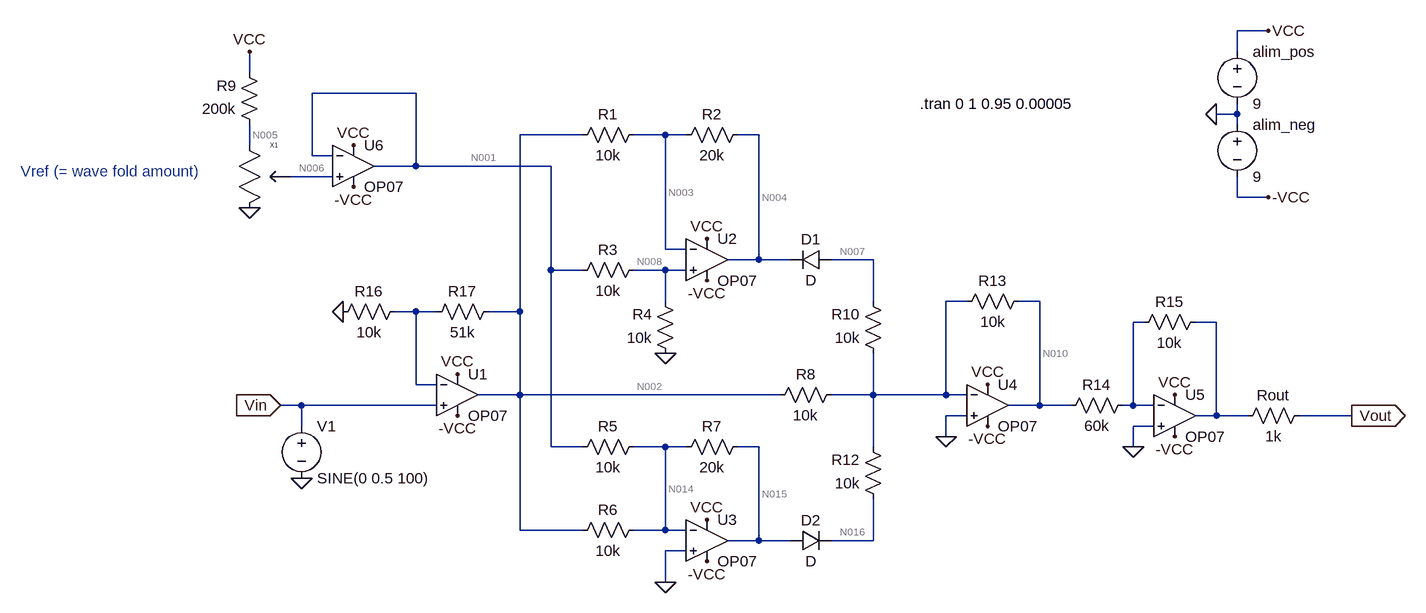
[diagram p0: schematic wave_folder.asc]
wave_folder.asc, the LTspice schematic file:
Version 4.1
SHEET 1 1104 780
WIRE 864 -384 816 -384
WIRE 816 -352 816 -384
WIRE -704 -320 -704 -352
WIRE -448 -288 -608 -288
WIRE 816 -256 816 -272
WIRE 816 -256 784 -256
WIRE 816 -240 816 -256
WIRE -192 -224 -288 -224
WIRE -64 -224 -112 -224
WIRE -32 -224 -64 -224
WIRE 80 -224 48 -224
WIRE -704 -208 -704 -240
WIRE -608 -192 -608 -288
WIRE -576 -192 -608 -192
WIRE -448 -176 -448 -288
WIRE -448 -176 -512 -176
WIRE -240 -176 -448 -176
WIRE -576 -160 -640 -160
WIRE 816 -128 816 -160
WIRE 864 -128 816 -128
WIRE -64 -48 -64 -224
WIRE -32 -48 -64 -48
WIRE 80 -32 80 -224
WIRE 80 -32 32 -32
WIRE 128 -32 80 -32
WIRE 256 -32 192 -32
WIRE -240 -16 -240 -176
WIRE -192 -16 -240 -16
WIRE -64 -16 -112 -16
WIRE -32 -16 -64 -16
WIRE -64 32 -64 -16
WIRE 256 32 256 -32
WIRE 400 32 368 32
WIRE 512 32 480 32
WIRE -448 48 -480 48
WIRE -416 48 -448 48
WIRE -288 48 -288 -224
WIRE -288 48 -336 48
WIRE 672 64 656 64
WIRE 784 64 752 64
WIRE -448 160 -448 48
WIRE -416 160 -448 160
WIRE -288 176 -288 48
WIRE -288 176 -352 176
WIRE 112 176 -288 176
WIRE 256 176 256 112
WIRE 256 176 192 176
WIRE 368 176 368 32
WIRE 368 176 256 176
WIRE 400 176 368 176
WIRE -624 192 -656 192
WIRE -416 192 -624 192
WIRE 512 192 512 32
WIRE 512 192 464 192
WIRE 560 192 512 192
WIRE 656 192 656 64
WIRE 656 192 640 192
WIRE 688 192 656 192
WIRE 400 208 368 208
WIRE 784 208 784 64
WIRE 784 208 752 208
WIRE 832 208 784 208
WIRE 992 208 912 208
WIRE -624 224 -624 192
WIRE 688 224 656 224
WIRE 368 240 368 208
WIRE -240 256 -240 -16
WIRE -192 256 -240 256
WIRE -64 256 -112 256
WIRE -32 256 -64 256
WIRE 80 256 48 256
WIRE 256 256 256 176
WIRE 656 256 656 224
WIRE -288 384 -288 176
WIRE -192 384 -288 384
WIRE -64 384 -64 256
WIRE -64 384 -112 384
WIRE -32 384 -64 384
WIRE 80 400 80 256
WIRE 80 400 32 400
WIRE 128 400 80 400
WIRE 256 400 256 336
WIRE 256 400 192 400
WIRE -32 416 -64 416
WIRE -64 464 -64 416
FLAG -656 192 Vin
IOPIN -656 192 In
FLAG 784 -256 0
FLAG 992 208 Vout
IOPIN 992 208 Out
FLAG 864 -384 VCC
FLAG 864 -128 -VCC
FLAG -384 144 VCC
FLAG 0 -64 VCC
FLAG 0 0 -VCC
FLAG -384 208 -VCC
FLAG -624 304 0
FLAG -64 112 0
FLAG -704 -352 VCC
FLAG 0 368 VCC
FLAG 0 432 -VCC
FLAG -64 464 0
FLAG 432 160 VCC
FLAG 432 224 -VCC
FLAG 368 240 0
FLAG -560 48 0
FLAG 720 176 VCC
FLAG 720 240 -VCC
FLAG 656 256 0
FLAG -544 -208 VCC
FLAG -544 -144 -VCC
FLAG -704 -112 0
SYMBOL res -96 -240 R90
WINDOW 0 0 56 VBottom 2
WINDOW 3 32 56 VTop 2
SYMATTR InstName R1
SYMATTR Value 10k
SYMBOL res -48 -208 R270
WINDOW 0 32 56 VTop 2
WINDOW 3 0 56 VBottom 2
SYMATTR InstName R2
SYMATTR Value 20k
SYMBOL res -96 -32 R90
WINDOW 0 0 56 VBottom 2
WINDOW 3 32 56 VTop 2
SYMATTR InstName R3
SYMATTR Value 10k
SYMBOL res -48 128 R180
WINDOW 0 36 76 Left 2
WINDOW 3 36 40 Left 2
SYMATTR InstName R4
SYMATTR Value 10k
SYMBOL OpAmps\\OP07 -384 112 R0
SYMATTR InstName U1
SYMBOL voltage 816 -368 R0
SYMATTR InstName alim_pos
SYMATTR Value 9
SYMBOL voltage 816 -256 R0
SYMATTR InstName alim_neg
SYMATTR Value 9
SYMBOL OpAmps\\OP07 432 128 R0
SYMATTR InstName U4
SYMBOL OpAmps\\OP07 0 -96 R0
SYMATTR InstName U2
SYMBOL pot -736 -192 R0
SYMATTR InstName X1
SYMATTR SpiceLine R = 100k val = 50
SYMBOL voltage -624 208 R0
WINDOW 123 0 0 Left 0
WINDOW 39 0 0 Left 0
SYMATTR InstName V1
SYMATTR Value SINE(0 0.5 100)
SYMBOL diode 192 -48 R90
WINDOW 0 0 32 VBottom 2
WINDOW 3 32 32 VTop 2
SYMATTR InstName D1
SYMBOL diode 128 416 R270
WINDOW 0 32 32 VTop 2
WINDOW 3 0 32 VBottom 2
SYMATTR InstName D2
SYMBOL res -96 240 R90
WINDOW 0 0 56 VBottom 2
WINDOW 3 32 56 VTop 2
SYMATTR InstName R5
SYMATTR Value 10k
SYMBOL res -208 400 R270
WINDOW 0 32 56 VTop 2
WINDOW 3 0 56 VBottom 2
SYMATTR InstName R6
SYMATTR Value 10k
SYMBOL res 64 240 R90
WINDOW 0 0 56 VBottom 2
WINDOW 3 32 56 VTop 2
SYMATTR InstName R7
SYMATTR Value 20k
SYMBOL res 96 192 R270
WINDOW 0 32 56 VTop 2
WINDOW 3 0 56 VBottom 2
SYMATTR InstName R8
SYMATTR Value 10k
SYMBOL OpAmps\\OP07 0 336 R0
SYMATTR InstName U3
SYMBOL res 272 128 R180
WINDOW 0 36 76 Left 2
WINDOW 3 36 40 Left 2
SYMATTR InstName R10
SYMATTR Value 10k
SYMBOL res 272 352 R180
WINDOW 0 36 76 Left 2
WINDOW 3 36 40 Left 2
SYMATTR InstName R12
SYMATTR Value 10k
SYMBOL res 384 48 R270
WINDOW 0 32 56 VTop 2
WINDOW 3 0 56 VBottom 2
SYMATTR InstName R13
SYMATTR Value 10k
SYMBOL res 656 176 R90
WINDOW 0 0 56 VBottom 2
WINDOW 3 32 56 VTop 2
SYMATTR InstName R14
SYMATTR Value 60k
SYMBOL res 768 48 R90
WINDOW 0 0 56 VBottom 2
WINDOW 3 32 56 VTop 2
SYMATTR InstName R15
SYMATTR Value 10k
SYMBOL res -464 32 R90
WINDOW 0 0 56 VBottom 2
WINDOW 3 32 56 VTop 2
SYMATTR InstName R16
SYMATTR Value 10k
SYMBOL res -320 32 R90
WINDOW 0 0 56 VBottom 2
WINDOW 3 32 56 VTop 2
SYMATTR InstName R17
SYMATTR Value 51k
SYMBOL OpAmps\\OP07 720 144 R0
SYMATTR InstName U5
SYMBOL res 928 192 R90
WINDOW 0 0 56 VBottom 2
WINDOW 3 32 56 VTop 2
SYMATTR InstName Rout
SYMATTR Value 1k
SYMBOL OpAmps\\OP07 -544 -240 R0
SYMATTR InstName U6
SYMBOL res -688 -224 R180
WINDOW 0 36 76 Left 2
WINDOW 3 36 40 Left 2
SYMATTR InstName R9
SYMATTR Value 200k
TEXT 328 -272 Left 2 !.tran 0 1 0.95 0.00005
TEXT -1056 -168 Left 2 ;Vref (= wave fold amount)

The netlist it stands for:
* wave_folder.asc
R1 N003 N002 10k
R2 N003 N004 20k
R3 N008 N001 10k
R4 0 N008 10k
X§U1 Vin N011 VCC -VCC N002 LT1001  ; OP07, pins In+ In- V+ V- OUT
V§alim_pos VCC 0 9
V§alim_neg 0 -VCC 9
X§U4 0 N009 VCC -VCC N010 LT1001  ; OP07, pins In+ In- V+ V- OUT
X§U2 N008 N003 VCC -VCC N004 LT1001  ; OP07, pins In+ In- V+ V- OUT
X§X1 N005 N006 0 pot R = 100k val = 50  ; pins 1 2 3
V1 Vin 0 SINE(0 0.5 100)
D1 N007 N004 D
D2 N015 N016 D
R5 N014 N001 10k
R6 N002 N014 10k
R7 N015 N014 20k
R8 N002 N009 10k
X§U3 0 N014 VCC -VCC N015 LT1001  ; OP07, pins In+ In- V+ V- OUT
R10 N009 N007 10k
R12 N016 N009 10k
R13 N009 N010 10k
R14 N012 N010 60k
R15 N013 N012 10k
R16 N011 0 10k
R17 N002 N011 51k
X§U5 0 N012 VCC -VCC N013 LT1001  ; OP07, pins In+ In- V+ V- OUT
Rout Vout N013 1k
X§U6 N006 N001 VCC -VCC N001 LT1001  ; OP07, pins In+ In- V+ V- OUT
R9 N005 VCC 200k
.model D D
.lib standard.dio
.tran 0 1 0.95 0.00005
* Vref (= wave fold amount)
.lib LTC.lib
.backanno
.end

* Results of the author's LTspice run, read from the files saved beside the schematic
* Operating Point, zero values left out:
*   V(n002) = 20.54 nV
*   V(n008) = 750 mV
*   V(n001) = 1.5 V
*   V(n005) = 3 V
*   V(n006) = 1.5 V
*   V(n015) = -3 V
*   V(n003) = 750 mV
*   V(n004) = 2.25 V
*   V(vcc) = 9 V
*   V(-vcc) = -9 V
*   V(n010) = -13.04 nV
*   V(n007) = 22.6 nV
*   V(n016) = -30.1 nV
*   V(n014) = 4.026 µV
*   I(R3) = -75 µA
*   I(alim_neg) = -13.46 mA
*   I(R6) = -400.6 pA
*   I(R7) = -150 µA
*   I(R12) = -3.01 pA
*   I(R1) = 75 µA
*   I(D2) = -3.01 pA
*   I(R9) = -30 µA
*   I(R2) = -75 µA
*   I(R4) = -75 µA
*   I(alim_pos) = -13.57 mA
*   I(R5) = -150 µA
*   I(R8) = 2.054 pA
*   I(R10) = -2.26 pA
*   I(R13) = 1.304 pA
*   I(D1) = -2.26 pA
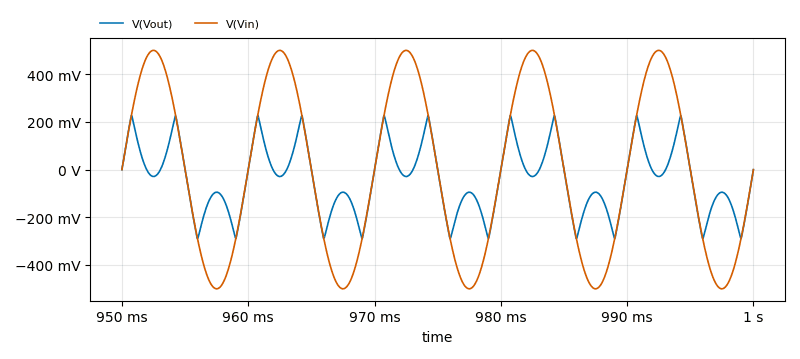
[diagram p1: Transient Analysis of wave_folder.asc, plotted from the saved traces]
* Transient Analysis, 1 run:
*   V(Vout): min -289.7 mV, max 227.1 mV, average -39.92 mV, rms 148 mV, last -530.9 µV
*   V(Vin): min -500 mV, max 500 mV, average -230.5 nV, rms 353.6 mV, last 0 V